# Altium project AD9851.PrjPcb
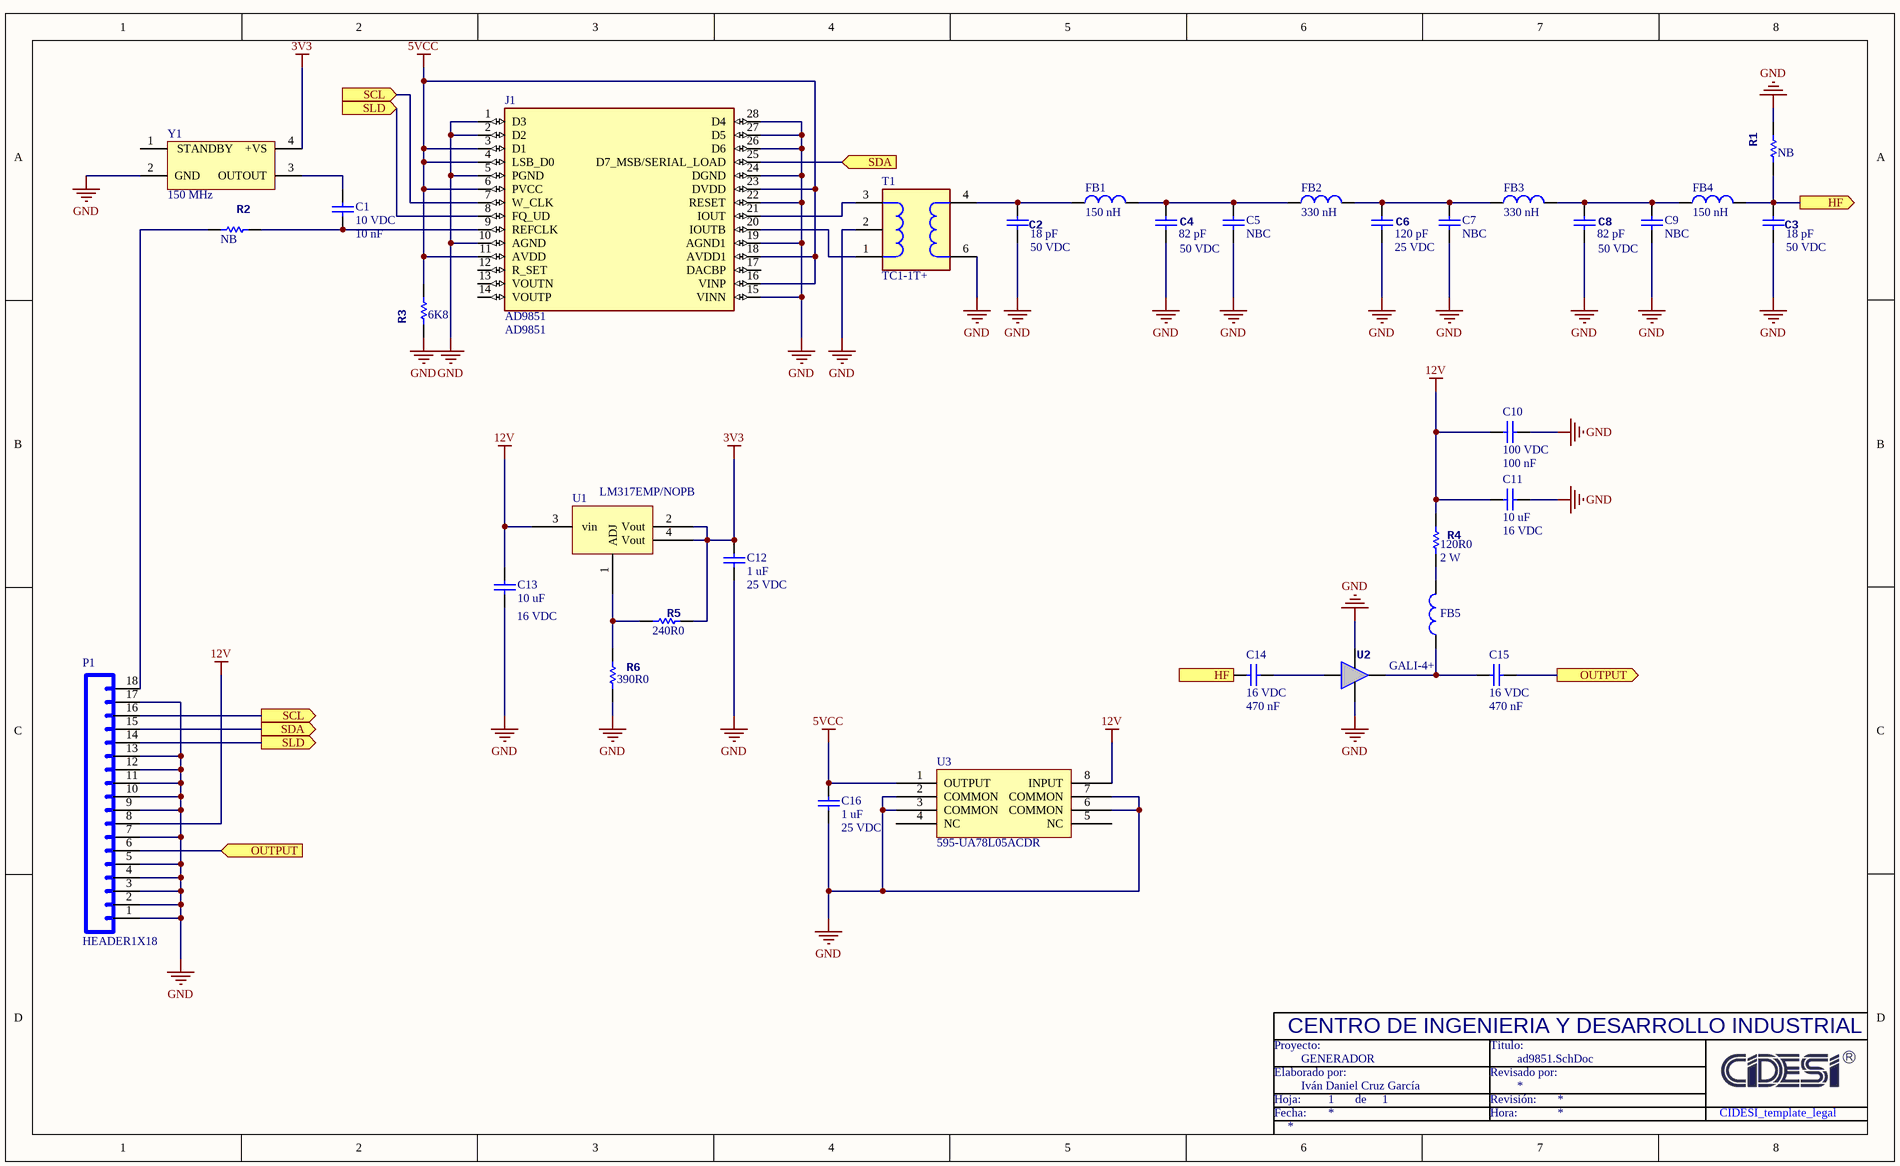
[diagram p0: ad9851.SchDoc]
1 sheet, 34 parts. Net scope: flat (ports and power ports of the same name join across sheets).
Board file: AD.PcbDoc

## Sheet ad9851.SchDoc
size Legal; Engineer: Iván Daniel Cruz García; SheetNumber: 1; SheetTotal: 1; Proyecto: GENERADOR

### Parts
C1  Voltage Rating DC: 10 VDC  Capacitance - nF: 10 nF  [C0603]  (hidden comment: 10nF, 10V)
C2  Capacitance: 18 pF  Voltage Rating DC: 50 VDC  [C0603]  (hidden comment: 18pF, 50V)
C3  Capacitance: 18 pF  Voltage Rating DC: 50 VDC  [C0603]  (hidden comment: 18pF, 50V)
C4  Capacitance: 82 pF  Voltage Rating DC: 50 VDC  [C0603]  (hidden comment: 82pF, 50V)
C5  NBC  [C0603]
C6  Capacitance: 120 pF  Voltage Rating DC: 25 VDC  [C0603]  (hidden comment: 120pF, 50V)
C7  NBC  [C0603]
C8  Capacitance: 82 pF  Voltage Rating DC: 50 VDC  [C0603]  (hidden comment: 82pF, 50V)
C9  NBC  [C0603]
C10  Voltage Rating DC: 100 VDC  Capacitance - nF: 100 nF  [C0603]  (hidden comment: 100nF, 16V)
C11  Capacitance: 10 uF  Voltage Rating DC: 16 VDC  [C0603]  (hidden comment: 10uF, 16V)
C12  Capacitance: 1 uF  Voltage Rating DC: 25 VDC  [C0603]  (hidden comment: 1uF, 25V)
C13  Capacitance: 10 uF  Voltage Rating DC: 16 VDC  [C0603]  (hidden comment: 10uF, 16V)
C14  Voltage Rating DC: 16 VDC  Capacitance - nF: 470 nF  [C0603]  (hidden comment: 470nF, 16V)
C15  Voltage Rating DC: 16 VDC  Capacitance - nF: 470 nF  [C0603]  (hidden comment: 470nF, 16V)
C16  Capacitance: 1 uF  Voltage Rating DC: 25 VDC  [C0603]  (hidden comment: 1uF, 25V)
FB1  Inductance: 150 nH  [SIMID 0805]  (hidden comment: 150nH)
FB2  Inductance: 330 nH  [SIMID 0805]  (hidden comment: 330nH)
FB3  Inductance: 330 nH  [SIMID 0805]  (hidden comment: 330nH)
FB4  Inductance: 150 nH  [SIMID 0805]  (hidden comment: 150nH)
FB5  NBI  [SIMID 0805]  (value not drawn)
J1  AD9851  [TSSOP28]
P1  HEADER1X18  [HEAD9-90]
R1  NB  [RESC0603]
R2  NB  [RESC0603]
R3  Resistance: 6K8  [RESC0603]  (hidden comment: 6K8, 100mW)
R4  Resistance: 120R0  Power Rating: 2 W  [RESC2512]  (hidden comment: 120R0, 2W)
R5  Resistance: 240R0  [RESC0603]  (hidden comment: 240R0, 100mW)
R6  Resistance: 390R0  [RESC0603]  (hidden comment: 390R0, 100mW)
T1  Manufacturer Part Number: TC1-1T+  [Mini-Circuits_0_MFG]  (hidden comment: Transformer)
U1  Manufacturer Part Number: LM317EMP/NOPB  [SOT-223-4]  (hidden comment: LM317EMP 3V3)
U2  GALI-4+  [SOT-89-3]
U3  Supplier Part Number 1: 595-UA78L05ACDR  [SOIC8]  (hidden comment: Voltage Regulator 5V)
Y1  Frequency: 150 MHz  [OScilator]  (hidden comment: OSCILATOR)

### Ports
HF (in), HF (out), OUTPUT (in), OUTPUT (out), SCL (in), SCL (out), SDA (in), SDA (out), SLD (in), SLD (out)

### Nets
3V3: C12.2 R5.2 U1.2(Vout) U1.4(Vout) Y1.4(+VS)
5VCC: C16.1 J1.3(D1) J1.4(LSB_D0) J1.6(PVCC) J1.11(AVDD) J1.16(VINP) J1.18(AVDD1) J1.23(DVDD) R3.2 U3.1(OUTPUT)
12V: C10.2 C11.1 C13.1 P1.8 R4.2 U1.3(vin) U3.8(INPUT)
GND: C2.2 C3.2 C4.2 C5.2 C6.2 C7.2 C8.2 C9.2 C10.1 C11.2 C12.1 C13.2 C16.2 J1.1(D3) J1.2(D2) J1.5(PGND) J1.10(AGND) J1.15(VINN) J1.19(AGND1) J1.22(RESET) J1.24(DGND) J1.26(D6) J1.27(D5) J1.28(D4) P1.1 P1.2 P1.3 P1.4 P1.5 P1.7 P1.9 P1.10 P1.11 P1.12 P1.13 P1.17 R1.2 R3.1 R6.1 T1.2 T1.6 U2.2 U2.4 U3.2(COMMON) U3.3(COMMON) U3.6(COMMON) U3.7(COMMON) Y1.2(GND)
NetC1_1: C1.1 Y1.3(OUTOUT)
NetC1_2: C1.2 J1.9(REFCLK) R2.2
NetC2_1: C2.1 FB1.1 T1.4
NetC3_1: C3.1 C14.1 FB4.2 R1.1 ; port HF
NetC4_1: C4.1 C5.1 FB1.2 FB2.1
NetC6_1: C6.1 C7.1 FB2.2 FB3.1
NetC8_1: C8.1 C9.1 FB3.2 FB4.1
NetC14_2: C14.2 U2.1
NetC15_1: C15.1 FB5.1 U2.3
NetC15_2: C15.2 P1.6 ; port OUTPUT
NetFB5_2: FB5.2 R4.1
NetJ1_7: J1.7(W_CLK) P1.16 ; port SCL
NetJ1_8: J1.8(FQ_UD) P1.14 ; port SLD
NetJ1_20: J1.20(IOUTB) T1.1
NetJ1_21: J1.21(IOUT) T1.3
NetJ1_25: J1.25(D7_MSB/SERIAL_LOAD) P1.15 ; port SDA
NetP1_18: P1.18 R2.1
NetR5_1: R5.1 R6.2 U1.1(ADJ)

Not connected (* = marked no-connect by the designer): J1 12(R_SET) 13(VOUTN) 14(VOUTP) 17(DACBP); U3 4(NC) 5(NC); Y1 1(STANDBY)

### Notes on the sheet
- Proyecto:
- CENTRO DE INGENIERIA Y DESARROLLO INDUSTRIAL
- Titulo:
- Fecha:
- Hoja:
- Elaborado por:
- de
- Hora:
- Revisión:
- Revisado por:
- CIDESI_template_legal

### Library data of the parts
C1 = 10nF, 10V: Cap_Cer; Manufacturer: Murata Electronics; Manufacturer Part Number: GRM1857U1A103JA44D; Capacitance: 0.01 uF; Tolerance: 5 %; Type: Chip Multilayer Ceramic Capacitor for General Purpose; Capacitance - pF: 10000 pF; Class: Class 1; Dielectric: U2J; Supplier 1: Mouser; RoHS: RoHS Compliant; Category: Multilayer Ceramic Capacitors MLCC - SMD/SMT; Stock 1: 8033; Pricing 1: 1=0.325, 10=0.221, 100=0.112, 500=0.075, 1000=0.068, 4000=0.046, 8000=0.044 (MXN); Height: 0.5 mm; Length: 1.6 mm; Package / Case: 0603 (1608 metric); Packaging: Cut Tape; Product: General Type MLCCs; Series: GRM; Termination Style: SMD/SMT; Width: 0.8 mm; Brand: Murata Electronics; Case Code - in: 0603; Case Code - mm: 1608; Maximum Operating Temperature: + 125 C; Minimum Operating Temperature: - 55 C; Product Type: Ceramic Capacitors; Standard Pack Qty: 4000; Subcategory: Capacitors; Termination: Standard; RoHS - Mouser: Y; Minimum Order Quantity: 1; Reeling: True; ComponentLink1URL: https://www.mouser.com/datasheet/2/281/murata_03052018_GRM_Series_1-1310166.pdf; ComponentLink1Description: https://www.mouser.com/datasheet/2/281/murata_03052018_GRM_Series_1-1310166.pdf; Supplier Part Number 1: 81-GRM1857U1A103JA4D
C2 C3 = 18pF, 50V: Cap_Cer; Manufacturer: AVX; Manufacturer Part Number: 06035A180J4T2A; Tolerance: 5 %; Type: Automotive MLCCs NP0 Dielectric; Dielectric: C0G (NP0); Qualification: AEC-Q200; Supplier 1: Mouser; RoHS: RoHS Compliant; Category: Multilayer Ceramic Capacitors MLCC - SMD/SMT; Stock 1: 122112; Pricing 1: 1=0.338, 10=0.234, 100=0.118, 500=0.081, 1000=0.072, 4000=0.053, 8000=0.051, 24000=0.043 (MXN); Height: 0.9 mm; Length: 1.6 mm; Package / Case: 0603 (1608 metric); Packaging: Cut Tape; Product: Automotive MLCCs; Series: AutoMLCC C0G(NP0); Termination Style: SMD/SMT; Width: 0.8 mm; Brand: AVX; Case Code - in: 0603; Case Code - mm: 1608; Maximum Operating Temperature: + 125 C; Minimum Operating Temperature: - 55 C; Product Type: Ceramic Capacitors; Standard Pack Qty: 4000; Subcategory: Capacitors; Termination: Standard; RoHS - Mouser: Y; Minimum Order Quantity: 1; Reeling: True; ComponentLink1URL: https://www.mouser.com/datasheet/2/40/AutoMLCC-777028.pdf; ComponentLink1Description: https://www.mouser.com/datasheet/2/40/AutoMLCC-777028.pdf; Supplier Part Number 1: 581-06035A180J4T2A
C4 C8 = 82pF, 50V: Cap_Cer; Manufacturer: AVX; Manufacturer Part Number: 06035A820KAT2A; Tolerance: 10 %; Type: C0G (NP0) Dielectric; Class: Class 1; Dielectric: C0G (NP0); Supplier 1: Mouser; RoHS: RoHS Compliant; Category: Multilayer Ceramic Capacitors MLCC - SMD/SMT; Stock 1: 22186; Pricing 1: 1=0.221, 10=0.163, 100=0.083, 500=0.066, 1000=0.065, 2000=0.051, 4000=0.049, 24000=0.034 (MXN); Height: 0.35 mm; Length: 1.6 mm; Package / Case: 0603 (1608 metric); Packaging: Cut Tape; Product: General Type MLCCs; Series: C0G (NP0); Termination Style: SMD/SMT; Width: 0.81 mm; Brand: AVX; Case Code - in: 0603; Case Code - mm: 1608; Maximum Operating Temperature: + 125 C; Minimum Operating Temperature: - 55 C; Product Type: Ceramic Capacitors; Standard Pack Qty: 4000; Subcategory: Capacitors; Termination: Standard; RoHS - Mouser: Y; Minimum Order Quantity: 1; Reeling: True; ComponentLink1URL: https://www.mouser.com/datasheet/2/40/C0GNP0-Dielectric-951274.pdf; ComponentLink1Description: https://www.mouser.com/datasheet/2/40/C0GNP0-Dielectric-951274.pdf; Supplier Part Number 1: 581-06035A820KAT2A
C5 C7 C9 = NBC: Cap_Cer
C6 = 120pF, 50V: Cap_Cer; Manufacturer: AVX; Manufacturer Part Number: 06033A121KAT2A; Tolerance: 10 %; Type: C0G (NP0) Dielectric; Capacitance - nF: 0.12 nF; Class: Class 1; Dielectric: C0G (NP0); Supplier 1: Mouser; RoHS: RoHS Compliant; Category: Multilayer Ceramic Capacitors MLCC - SMD/SMT; Stock 1: 8626; Pricing 1: 1=0.312, 10=0.221, 100=0.112, 500=0.077, 1000=0.068, 2000=0.051, 4000=0.051, 24000=0.040 (MXN); Height: 0.35 mm; Length: 1.6 mm; Package / Case: 0603 (1608 metric); Packaging: Cut Tape; Product: General Type MLCCs; Series: C0G (NP0); Termination Style: SMD/SMT; Width: 0.81 mm; Brand: AVX; Case Code - in: 0603; Case Code - mm: 1608; Maximum Operating Temperature: + 125 C; Minimum Operating Temperature: - 55 C; Product Type: Ceramic Capacitors; Standard Pack Qty: 4000; Subcategory: Capacitors; Termination: Standard; RoHS - Mouser: Y; Minimum Order Quantity: 1; Reeling: True; ComponentLink1URL: https://www.mouser.com/datasheet/2/40/C0GNP0-Dielectric-951274.pdf; ComponentLink1Description: https://www.mouser.com/datasheet/2/40/C0GNP0-Dielectric-951274.pdf; Supplier Part Number 1: 581-06033A121KAT2A
C10 = 100nF, 16V: Cap_Cer; Manufacturer: Murata Electronics; Manufacturer Part Number: GRM188R72A104KA35J; Capacitance: 0.1 uF; Tolerance: 10 %; Type: Chip Multilayer Ceramic Capacitor for General Purpose; Capacitance - pF: 100000 pF; Class: Class 2; Dielectric: X7R; Supplier 1: Mouser; RoHS: RoHS Compliant; Category: Multilayer Ceramic Capacitors MLCC - SMD/SMT; Stock 1: 69028; Pricing 1: 1=0.403, 10=0.276, 100=0.156, 500=0.111, 1000=0.096, 2500=0.079, 5000=0.073, 10000=0.066, 20000=0.061 (MXN); Height: 0.8 mm; Length: 1.6 mm; Package / Case: 0603 (1608 metric); Packaging: Cut Tape; Product: General Type MLCCs; Series: GRM; Termination Style: SMD/SMT; Width: 0.8 mm; Brand: Murata Electronics; Case Code - in: 0603; Case Code - mm: 1608; Maximum Operating Temperature: + 125 C; Minimum Operating Temperature: - 55 C; Product Type: Ceramic Capacitors; Standard Pack Qty: 10000; Subcategory: Capacitors; Termination: Standard; RoHS - Mouser: Y; Minimum Order Quantity: 1; Reeling: True; ComponentLink1URL: https://www.mouser.com/datasheet/2/281/murata_03052018_GRM_Series_1-1310166.pdf; ComponentLink1Description: https://www.mouser.com/datasheet/2/281/murata_03052018_GRM_Series_1-1310166.pdf; Supplier Part Number 1: 81-GRM188R72A104KA5J
C11 C13 = 10uF, 16V: Cap_Cer; Manufacturer: Murata Electronics; Manufacturer Part Number: GRM188C81C106MA73D; Tolerance: 20 %; Type: Chip Multilayer Ceramic Capacitor for General Purpose; Class: Class 2; Dielectric: X6S; Supplier 1: Mouser; RoHS: RoHS Compliant; Category: Multilayer Ceramic Capacitors MLCC - SMD/SMT; Stock 1: 24410; Pricing 1: 1=0.598, 10=0.419, 100=0.251, 500=0.187, 1000=0.159, 4000=0.112, 8000=0.105 (MXN); Height: 0.8 mm; Length: 1.6 mm; Package / Case: 0603 (1608 metric); Packaging: Cut Tape; Product: General Type MLCCs; Series: GRM; Termination Style: SMD/SMT; Width: 0.8 mm; Brand: Murata Electronics; Case Code - in: 0603; Case Code - mm: 1608; Maximum Operating Temperature: + 105 C; Minimum Operating Temperature: - 55 C; Product Type: Ceramic Capacitors; Standard Pack Qty: 4000; Subcategory: Capacitors; Termination: Standard; RoHS - Mouser: Y; Minimum Order Quantity: 1; Reeling: True; ComponentLink1URL: https://www.mouser.com/datasheet/2/281/murata_03052018_GRM_Series_1-1310166.pdf; ComponentLink1Description: https://www.mouser.com/datasheet/2/281/murata_03052018_GRM_Series_1-1310166.pdf; Supplier Part Number 1: 81-GRM188C81C106MA3D
C12 C16 = 1uF, 25V: Cap_Cer; Manufacturer: AVX; Manufacturer Part Number: 06033C105KAT2A; Tolerance: 10 %; Type: X7R MLC Capacitors; Capacitance - nF: 1000 nF; Class: Class 2; Dielectric: X7R; Supplier 1: Mouser; RoHS: RoHS Compliant; Category: Multilayer Ceramic Capacitors MLCC - SMD/SMT; Stock 1: 85860; Pricing 1: 1=0.390, 10=0.218, 100=0.186, 500=0.131, 1000=0.114, 2000=0.112, 4000=0.100, 8000=0.086, 24000=0.075 (MXN); Height: 0.35 mm; Length: 1.6 mm; Package / Case: 0603 (1608 metric); Packaging: Cut Tape; Product: General Type MLCCs; Series: MLCC X7R; Termination Style: SMD/SMT; Width: 0.8 mm; Brand: AVX; Case Code - in: 0603; Case Code - mm: 1608; Maximum Operating Temperature: + 125 C; Minimum Operating Temperature: - 55 C; Product Type: Ceramic Capacitors; Standard Pack Qty: 4000; Subcategory: Capacitors; Termination: Standard; RoHS - Mouser: Y; Minimum Order Quantity: 1; Reeling: True; ComponentLink1URL: https://www.mouser.com/datasheet/2/40/X7RDielectric-777024.pdf; ComponentLink1Description: https://www.mouser.com/datasheet/2/40/X7RDielectric-777024.pdf; Supplier Part Number 1: 581-06033C105KAT2A
C14 C15 = 470nF, 16V: Cap_Cer; Manufacturer: KEMET; Manufacturer Part Number: C0603X474J4RACTU; Capacitance: 0.47 uF; Tolerance: 5 %; Capacitance - pF: 470000 pF; Class: Class 2; Dielectric: X7R; Product Status: New Product; Supplier 1: Mouser; RoHS: RoHS Compliant; Category: Multilayer Ceramic Capacitors MLCC - SMD/SMT; Stock 1: 2631; Pricing 1: 1=1.07, 10=0.712, 100=0.443, 500=0.400, 1000=0.367, 4000=0.238, 8000=0.226, 24000=0.221, 48000=0.213 (MXN); Height: 0.8 mm; Length: 1.6 mm; Package / Case: 0603 (1608 metric); Packaging: Cut Tape; Product: General Type MLCCs; Series: SMD Comm X7R Flex; Termination Style: SMD/SMT; Width: 0.8 mm; Brand: KEMET; Case Code - in: 0603; Case Code - mm: 1608; Maximum Operating Temperature: + 125 C; Minimum Operating Temperature: - 55 C; Product Type: Ceramic Capacitors; Standard Pack Qty: 4000; Subcategory: Capacitors; Termination: Flexible (Soft); Tradename: FT-CAP; RoHS - Mouser: Y; Minimum Order Quantity: 1; Reeling: True; ComponentLink1URL: https://www.mouser.com/datasheet/2/212/1/KEM_C1013_X7R_FT_CAP_SMD-1103280.pdf; ComponentLink1Description: https://www.mouser.com/datasheet/2/212/1/KEM_C1013_X7R_FT_CAP_SMD-1103280.pdf; Supplier Part Number 1: 80-C0603X474J4RACTU
FB1 FB4 = 150nH: Inductor; Manufacturer: EPCOS / TDK; Manufacturer Part Number: B82498F3151G000; Maximum DC Current: 0.4 A; Maximum DC Resistance: 420 mOhms; Q Minimum: 45; Tolerance: 2 %; Supplier 1: Mouser; RoHS: RoHS Compliant; Category: Fixed Inductors; Stock 1: 0; Pricing 1: 6000=0.378, 24000=0.365 (MXN); Package / Case: 0805 (2012 metric); Packaging: Reel; Product: Fixed Inductors; Series: B82498F; Termination Style: SMD/SMT; Brand: EPCOS / TDK; Mounting Style: PCB Mount; Case Code - in: 0805; Case Code - mm: 2012; Maximum Operating Temperature: + 150 C; Minimum Operating Temperature: - 55 C; Product Type: Fixed Inductors; Standard Pack Qty: 6000; Subcategory: Inductors, Chokes & Coils; Termination: -; RoHS - Mouser: Y; Minimum Order Quantity: 6000; Reeling: True; Supplier Part Number 1: 871-B82498F3151G000
FB2 FB3 = 330nH: Inductor; Manufacturer: EPCOS / TDK; Manufacturer Part Number: B82498F3331J; Core Material: Ceramic; Maximum DC Current: 220 mA; Maximum DC Resistance: 1.5 Ohms; Q Minimum: 45; Self Resonant Frequency: 800 MHz; Shielding: Unshielded; Tolerance: 5 %; Test Frequency: 100 MHz; Supplier 1: Mouser; RoHS: RoHS Compliant By Exemption; Category: Fixed Inductors; Stock 1: 8486; Pricing 1: 1=0.988, 10=0.880, 100=0.660, 500=0.572, 1000=0.484, 2500=0.356, 6000=0.312, 24000=0.302, 48000=0.291 (MXN); Height: 1.4 mm; Length: 2.3 mm; Package / Case: 0805 (2012 metric); Packaging: Cut Tape; Product: Fixed Inductors; Series: B82498F; Termination Style: SMD/SMT; Width: 1.7 mm; Brand: EPCOS / TDK; Mounting Style: PCB Mount; Case Code - in: 0805; Case Code - mm: 2012; Maximum Operating Temperature: + 150 C; Minimum Operating Temperature: - 55 C; Product Type: Fixed Inductors; Standard Pack Qty: 6000; Subcategory: Inductors, Chokes & Coils; Termination: -; RoHS - Mouser: E; Minimum Order Quantity: 1; Reeling: True; Supplier Part Number 1: 871-B82498F3331J
FB5 = NBI: Inductor
J1 = AD9851: DDS/DAC Synthesizer; Manufacturer: Analog Devices; Manufacturer Part Number: AD9851BRSZ; Number of Converters: 1 Converter; Resolution: 10 bit; Interface Type: Serial; Number of Channels: 1 Channel; Operating Supply Voltage: 2.7 V to 5.25 V; Supplier 1: Mouser; RoHS: RoHS Compliant; Category: Data Acquisition ADCs/DACs - Specialized; Stock 1: 363; Pricing 1: 1=38.74, 5=37.99, 10=35.72, 25=34.11, 50=33.23, 100=30.03, 250=27.69, 500=26.27 (MXN); Height: 1.75 mm; Length: 10.2 mm; Package / Case: SSOP-28; Packaging: Tube; Product: DDS Direct Digital Synthesis ICs; Type: DDS/DAC Synthesizer; Width: 5.3 mm; Brand: Analog Devices; Mounting Style: SMD/SMT; Maximum Operating Temperature: + 85 C; Minimum Operating Temperature: - 40 C; Product Type: Data Acquisition ADCs/DACs - Specialized; Standard Pack Qty: 47; Subcategory: Data Converter ICs; RoHS - Mouser: Y; Minimum Order Quantity: 1; Reeling: False; ComponentLink1URL: https://www.mouser.com/datasheet/2/609/AD9851-1502703.pdf; ComponentLink1Description: https://www.mouser.com/datasheet/2/609/AD9851-1502703.pdf; Supplier Part Number 1: 584-AD9851BRSZ; Series: AD9851
P1 = HEADER1X18: HEADER; Manufacturer: Amphenol FCI; Manufacturer Part Number: 68000-236HLF; Current Rating: 3 A; Mounting Angle: Straight; Number of Positions: 36 Position; Voltage Rating: 1.5 kV; Pitch: 2.54 mm; Insulation Resistance: 5 GOhms; Mating Post Length: 5.84 mm; Supplier 1: Mouser; RoHS: RoHS Compliant; Category: Headers & Wire Housings; Stock 1: 48; Pricing 1: 1=1.89, 10=1.65, 100=1.47, 200=1.42, 500=1.23, 1000=1.00 (MXN); Contact Plating: Gold; Housing Material: Thermoplastic (TP); Number of Rows: 1 Row; Packaging: Bulk; Product: Headers; Termination Style: Solder Pin; Type: Pin Strip; Brand: Amphenol FCI; Contact Material: Phosphor Bronze; Flammability Rating: UL 94 V-0; Mounting Style: -; Contact Gender: Pin (Male); Housing Color: Black; Housing Gender: -; Maximum Operating Temperature: + 125 C; Minimum Operating Temperature: - 65 C; Product Type: Headers & Wire Housings; Standard Pack Qty: 100; Subcategory: Headers & Wire Housings; Termination Post Length: 2.41 mm; Tradename: BergStik; RoHS - Mouser: Y; Minimum Order Quantity: 1; Reeling: False; ComponentLink1URL: https://www.mouser.com/datasheet/2/18/68000-1266375.pdf; ComponentLink1Description: https://www.mouser.com/datasheet/2/18/68000-1266375.pdf; Supplier Part Number 1: 649-68000-236HLF
R1 R2 = NB: Resistor; Resistance: NB
R3 = 6K8, 100mW: Resistor; Manufacturer: Vishay / Dale; Manufacturer Part Number: CRCW06036K80JNEA; Power Rating: 100 mW (1/10 W); Temperature Coefficient: 200 PPM / C; Tolerance: 5 %; Voltage Rating: 75 V; Qualification: AEC-Q200; Supplier 1: Mouser; RoHS: RoHS Compliant By Exemption; Category: Thick Film Resistors - SMD; Stock 1: 18989; Pricing 1: 1=0.130, 10=0.042, 100=0.017, 1000=0.007, 5000=0.004 (MXN); Application: Automotive Grade; Features: -; Height: 0.45 mm; Length: 1.55 mm; Package / Case: -; Packaging: Cut Tape; Product: Thick Film Resistors SMD; Series: D/CRCW e3; Technology: Thick Film; Termination Style: SMD/SMT; Type: Chip Resistor; Width: 0.85 mm; Brand: Vishay / Dale; Mounting Style: PCB Mount; Case Code - in: 0603; Case Code - mm: 1608; Maximum Operating Temperature: + 155 C; Minimum Operating Temperature: - 55 C; Product Type: Thick Film Resistors; Standard Pack Qty: 5000; Subcategory: Resistors; RoHS - Mouser: E; Minimum Order Quantity: 1; Reeling: True; ComponentLink1URL: https://www.mouser.com/datasheet/2/427/dcrcwe3-1762152.pdf; ComponentLink1Description: https://www.mouser.com/datasheet/2/427/dcrcwe3-1762152.pdf; Supplier Part Number 1: 71-CRCW0603J-6.8K-E3
R4 = 120R0, 2W: Resistor; Manufacturer: Yageo; Manufacturer Part Number: RC2512FK-7W120RL; Temperature Coefficient: 100 PPM / C; Tolerance: 1 %; Voltage Rating: 200 V; Supplier 1: Mouser; RoHS: RoHS Compliant By Exemption; Category: Thick Film Resistors - SMD; Stock 1: 0; Pricing 1: 1=0.650, 10=0.460, 100=0.261, 1000=0.212, 4000=0.182, 8000=0.176, 24000=0.172, 48000=0.170 (MXN); Application: High Reliability; Features: -; Height: 0.55 mm; Length: 6.35 mm; Package / Case: -; Packaging: Cut Tape; Product: Thick Film Resistors SMD; Series: RC; Technology: Thick Film; Termination Style: SMD/SMT; Type: General Purpose; Width: 3.1 mm; Brand: Yageo; Mounting Style: PCB Mount; Case Code - in: 2512; Case Code - mm: 6332; Maximum Operating Temperature: + 155 C; Minimum Operating Temperature: - 55 C; Product Type: Thick Film Resistors; Standard Pack Qty: 4000; Subcategory: Resistors; RoHS - Mouser: E; Minimum Order Quantity: 1; Reeling: True; ComponentLink1URL: https://www.mouser.com/datasheet/2/447/PYu-RC_Group_51_RoHS_L_10-1664068.pdf; ComponentLink1Description: https://www.mouser.com/datasheet/2/447/PYu-RC_Group_51_RoHS_L_10-1664068.pdf; Supplier Part Number 1: 603-RC2512FK-7W120RL
R5 = 240R0, 100mW: Resistor; Manufacturer: Vishay / Dale; Manufacturer Part Number: CRCW0603240RFKEAC; Power Rating: 100 mW (1/10 W); Temperature Coefficient: 100 PPM / C; Tolerance: 1 %; Voltage Rating: 75 V; Supplier 1: Mouser; RoHS: RoHS Compliant By Exemption; Category: Thick Film Resistors - SMD; Stock 1: 66523; Pricing 1: 1=0.221, 10=0.086, 100=0.049, 500=0.047, 1000=0.034, 5000=0.010, 25000=0.008 (MXN); Features: -; Height: 0.45 mm; Length: 1.55 mm; Package / Case: -; Packaging: Cut Tape; Product: Thick Film Resistors SMD; Series: CRCW-C e3; Technology: Thick Film; Termination Style: SMD/SMT; Width: 0.85 mm; Brand: Vishay / Dale; Mounting Style: PCB Mount; Case Code - in: 0603; Case Code - mm: 1608; Maximum Operating Temperature: + 155 C; Minimum Operating Temperature: - 55 C; Product Type: Thick Film Resistors; Standard Pack Qty: 5000; Subcategory: Resistors; RoHS - Mouser: E; Minimum Order Quantity: 1; Reeling: True; ComponentLink1URL: https://www.mouser.com/datasheet/2/427/crcwce3-1762584.pdf; ComponentLink1Description: https://www.mouser.com/datasheet/2/427/crcwce3-1762584.pdf; Supplier Part Number 1: 71-CRCW0603240RFKEAC
R6 = 390R0, 100mW: Resistor; Manufacturer: Vishay / Dale; Manufacturer Part Number: CRCW0603390RFKEA; Power Rating: 100 mW (1/10 W); Temperature Coefficient: 100 PPM / C; Tolerance: 1 %; Voltage Rating: 75 V; Qualification: AEC-Q200; Supplier 1: Mouser; RoHS: RoHS Compliant By Exemption; Category: Thick Film Resistors - SMD; Stock 1: 33010; Pricing 1: 1=0.130, 10=0.048, 100=0.034, 500=0.020, 1000=0.008, 5000=0.007, 25000=0.005 (MXN); Application: Automotive Grade; Features: -; Height: 0.45 mm; Length: 1.55 mm; Package / Case: -; Packaging: Cut Tape; Product: Thick Film Resistors SMD; Series: D/CRCW e3; Technology: Thick Film; Termination Style: SMD/SMT; Type: Chip Resistor; Width: 0.85 mm; Brand: Vishay / Dale; Mounting Style: PCB Mount; Case Code - in: 0603; Case Code - mm: 1608; Maximum Operating Temperature: + 155 C; Minimum Operating Temperature: - 55 C; Product Type: Thick Film Resistors; Standard Pack Qty: 5000; Subcategory: Resistors; RoHS - Mouser: E; Minimum Order Quantity: 1; Reeling: True; ComponentLink1URL: https://www.mouser.com/datasheet/2/427/dcrcwe3-1762152.pdf; ComponentLink1Description: https://www.mouser.com/datasheet/2/427/dcrcwe3-1762152.pdf; Supplier Part Number 1: 71-CRCW0603-390-E3
T1 = Transformer: Signal Transformers; Manufacturer: Mini-Circuits; Frequency Range: 0.4 MHz to 500 MHz; Maximum DC Current: 30 mA; Power Rating: 0.25 W; Primary Impedance: 50 Ohms; Type: SMT Transformers; Number of Channels: 1 Channel; Product Status: New Product; Supplier 1: Mouser; RoHS: RoHS Compliant; Category: Audio Transformers / Signal Transformers; Stock 1: 4441; Pricing 1: 1=3.42, 10=2.99, 100=2.60, 500=2.15, 1000=1.89, 2000=1.76, 4000=1.69 (MXN); Height: 4.06 mm; Length: 3.81 mm; Package / Case: 3.81 mm x 3.81 mm x 4.06 mm; Packaging: Cut Tape; Product: RF; Secondary Impedance: 50 Ohms; Series: TC1; Termination Style: SMD/SMT; Width: 3.81 mm; Brand: Mini-Circuits; Maximum Operating Temperature: + 85 C; Minimum Operating Temperature: - 40 C; Product Type: Audio & Signal Transformers; Standard Pack Qty: 2000; Subcategory: Transformers; RoHS - Mouser: Y; Minimum Order Quantity: 1; Reeling: True; ComponentLink1URL: https://www.mouser.com/datasheet/2/1030/TC1-1T_2b-1701206.pdf; ComponentLink1Description: https://www.mouser.com/datasheet/2/1030/TC1-1T_2b-1701206.pdf; Supplier Part Number 1: 139-TC1-1T
U1 = LM317EMP 3V3: Voltage Regulator; Manufacturer: Texas Instruments; Input Voltage MAX: 40 V; Number of Outputs: 1 Output; Output Current: 1 A; Output Type: Adjustable; Output Voltage: 1.2 V to 37 V; PSRR / Ripple Rejection - Typ: 80 dB; Input Voltage MIN: 4.2 V; Line Regulation: 0.04 %/V; Load Regulation: 0.5 %; Polarity: Positive; Supplier 1: Mouser; RoHS: RoHS Compliant; Category: Linear Voltage Regulators; Stock 1: 20391; Pricing 1: 1=1.63, 10=1.38, 100=1.06, 250=0.935, 500=0.885, 1000=0.689, 2000=0.654, 5000=0.629, 10000=0.610 (MXN); Operating Temperature Range: 0 C to + 125 C; Package / Case: SOT-223-4; Packaging: Cut Tape; Series: LM317-N; Brand: Texas Instruments; Mounting Style: SMD/SMT; Maximum Operating Temperature: + 125 C; Minimum Operating Temperature: 0 C; Product Type: Linear Voltage Regulators; Standard Pack Qty: 1000; Subcategory: PMIC - Power Management ICs; RoHS - Mouser: Y; Minimum Order Quantity: 1; Reeling: True; Supplier Part Number 1: 926-LM317EMP/NOPB
U2 = GALI-4+: AMPLIFIER; Manufacturer: Mini-Circuits; Operating Frequency: 0 Hz to 4 GHz; Gain: 13.1 dB; Number of Channels: 1 Channel; Input Return Loss: 21 dB; NF - Noise Figure: 4 dB; OIP3 - Third Order Intercept: 34 dBm; Operating Supply Current: 65 mA; Operating Supply Voltage: 4.6 V; P1dB - Compression Point: 17.5 dBm; Test Frequency: 1 GHz; Product Status: New Product; Supplier 1: Mouser; RoHS: RoHS Compliant; Category: RF Amplifier; Stock 1: 700; Pricing 1: 1=4.21, 10=3.98, 25=3.45, 100=3.28, 250=2.94, 500=2.47, 1000=2.35, 2000=2.26, 5000=2.21 (MXN); Package / Case: SOT-89-4; Packaging: Cut Tape; Series: GALI; Technology: GaAs InGaP; Type: Gain Block; Brand: Mini-Circuits; Mounting Style: SMD/SMT; Maximum Operating Temperature: + 85 C; Minimum Operating Temperature: - 45 C; Product Type: RF Amplifier; Standard Pack Qty: 1000; Subcategory: Wireless & RF Integrated Circuits; RoHS - Mouser: Y; Minimum Order Quantity: 1; Reeling: True; ComponentLink1URL: https://www.mouser.com/datasheet/2/1030/GALI-4_2b-1700699.pdf; ComponentLink1Description: https://www.mouser.com/datasheet/2/1030/GALI-4_2b-1700699.pdf; Supplier Part Number 1: 139-GALI-4; Manufacturer Part Number: GALI-4+
U3 = Voltage Regulator 5V: Voltage Regulator; Manufacturer: Texas Instruments; Manufacturer Part Number: UA78L05ACDR; Input Voltage MAX: 20 V; Number of Outputs: 1 Output; Output Current: 100 mA; Output Type: Fixed; PSRR / Ripple Rejection - Typ: 49 dB; Input Voltage MIN: 7 V; Line Regulation: 150 mV; Load Regulation: 60 mV; Polarity: Positive; Supplier 1: Mouser; RoHS: RoHS Compliant; Category: Linear Voltage Regulators; Stock 1: 72184; Pricing 1: 1=0.637, 10=0.464, 100=0.260, 500=0.238, 1000=0.178, 2500=0.168, 5000=0.157, 10000=0.144, 25000=0.139 (MXN); Height: 1.58 mm; Length: 4.9 mm; Operating Temperature Range: - 40 C to + 125 C; Output Voltage: 5 V; Package / Case: SOIC-8; Packaging: Cut Tape; Series: UA78L05A; Width: 3.91 mm; Brand: Texas Instruments; Mounting Style: SMD/SMT; Maximum Operating Temperature: + 125 C; Minimum Operating Temperature: - 40 C; Product Type: Linear Voltage Regulators; Standard Pack Qty: 2500; Subcategory: PMIC - Power Management ICs; RoHS - Mouser: Y; Minimum Order Quantity: 1; Reeling: True
Y1 = OSCILATOR: Crystal Oscillator; Manufacturer: ABRACON; Manufacturer Part Number: ASV-150.000MHZ-E-C-T; Frequency Stability: 30 PPM; Operating Supply Voltage: 3 V; Supplier 1: Mouser; RoHS: RoHS Compliant; Category: Standard Clock Oscillators; Stock 1: 654; Pricing 1: 1=4.90, 10=4.65, 25=4.59, 50=4.50, 100=4.29, 250=4.16, 500=4.11, 1000=3.38, 2000=3.25 (MXN); Height: 1.8 mm; Length: 7 mm; Package / Case: 7 mm x 5 mm; Packaging: Cut Tape; Series: ASV; Termination Style: SMD/SMT; Type: XO - Crystal Clock Oscillators; Width: 5.08 mm; Brand: ABRACON; Mounting Style: SMD/SMT; Product Type: Clock Oscillators; Standard Pack Qty: 1000; Subcategory: Oscillators; RoHS - Mouser: Y; Minimum Order Quantity: 1; Reeling: True; ComponentLink1URL: https://www.mouser.com/datasheet/2/3/ASV-24925.pdf; ComponentLink1Description: https://www.mouser.com/datasheet/2/3/ASV-24925.pdf; Supplier Part Number 1: 815-ASV-150.0M-ECT